# EAGLE design msp430g2330_dip (EAGLE 6.5.0)
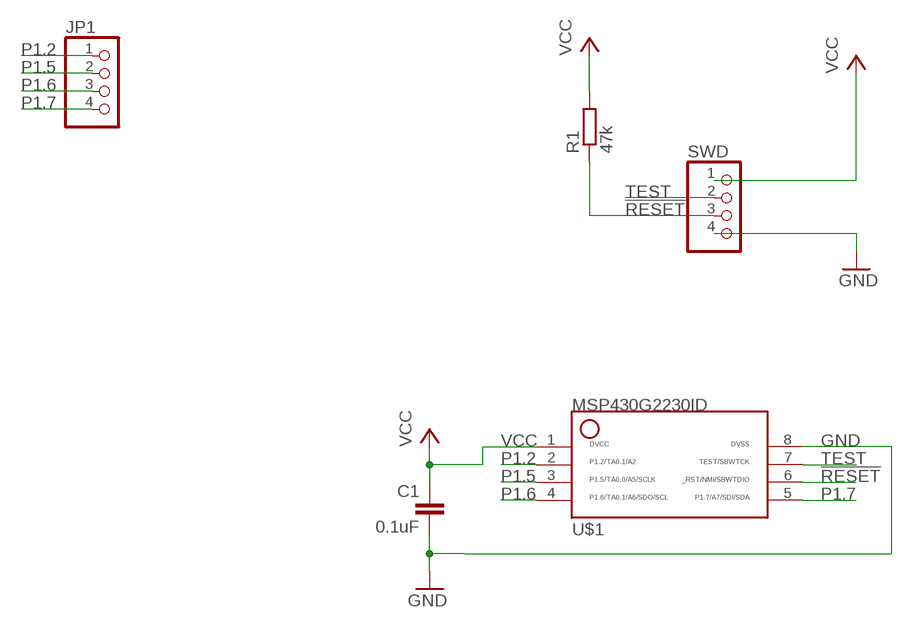
[diagram p0: schematic, sheet 1]

## Parts
C1  0.1uF  C-EUC0805  [C0805]
JP1  PINHD-1X4  [1X04]
R1  47k  R-EU_R0805  [R0805]
SWD  PINHD-1X4  [1X04]
U$1  MSP430G2230ID  [SO08]

## Nets
!RESET: R1.1 SWD.3 U$1.6
GND [GND]: C1.2 SWD.4 U$1.8
P1.2: JP1.1 U$1.2
P1.5: JP1.2 U$1.3
P1.6: JP1.3 U$1.4
P1.7: JP1.4 U$1.5
TEST: SWD.2 U$1.7
VCC [VCC]: C1.1 R1.2 SWD.1 U$1.1

## Library data of the parts
C1 = resistor:C-EU: CAPACITOR, European symbol
JP1 SWD = pinhead:PINHD-1X4: PIN HEADER
R1 = resistor:R-EU_: RESISTOR, European symbol
U$1 = thierry_eagle:MSP430G2230ID

## Net classes
0 default: width 0.305 mm, drill 0.508 mm
1 GND: width 0.813 mm, drill 0.508 mm
2 VCC: width 0.813 mm, drill 0.508 mm

## Board
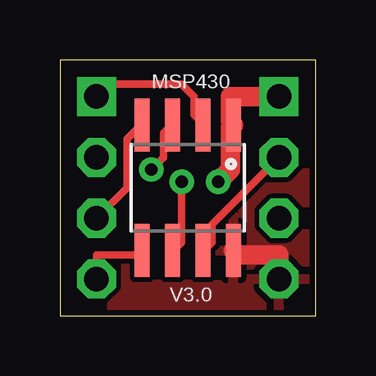
[diagram p1: board, top side]
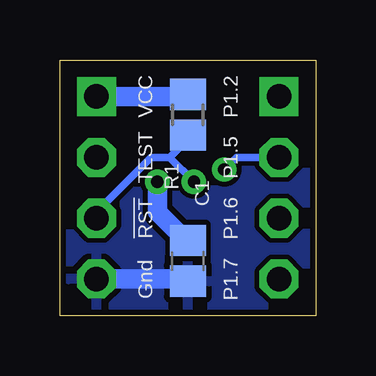
[diagram p2: board, bottom side, seen from below]

Size 10.67 x 10.67 mm. Coordinates in mm from the lower left corner, seen from the top.
Outline: 0,0 10.67,0 10.67,10.67 0,10.67 0,0
Copper layers (1*16): Top 0.035mm / dielectric 1.5mm / Bottom 0.035mm
Design rules "SparkFun *": minimum track width 12mil, minimum drill 20mil, track to track 8mil, track to pad 8mil, pad to pad 8mil, via to via 8mil, smd to smd 8mil, copper to edge 10mil, drill to drill 8mil, minimum pad ring 12mil, minimum via ring 10mil, stop-mask expansion 4mil, vias tented up to drill 25mil, thermal gap 10mil

### Footprints (pad centres in the part's own frame; a part is rotated, then mirrored left to right if it is on the bottom)
C0805 = smd 1.3 x 1.5: 1 -0.85,0; 2 0.85,0
1X04 = drill 1.016 square: 1 -3.81,0 | drill 1.016 octagon: 2 -1.27,0; 3 1.27,0; 4 3.81,0
R0805 = smd 1.3 x 1.5: 1 -0.85,0; 2 0.85,0
SO08 = smd 0.61 x 2.21: 1 -1.905,-2.616; 2 -0.635,-2.616; 3 0.635,-2.616; 4 1.905,-2.616; 5 1.905,2.616; 6 0.635,2.616; 7 -0.635,2.616; 8 -1.905,2.616

### Placement (x,y rotation side)
C1  5.33,2.29 270 bottom
JP1  1.52,5.33 270 top
R1  5.33,8.38 90 bottom
SWD  9.14,5.33 270 top
U$1  5.33,5.33 180 top

### Tracks (layer width: path | path; a pad name or v marks a point on that pad's centre or on a via)
!RESET  (via drill 0.51)
  Top 0.305: v5.08,5.59 5.08,3.05 4.83,2.79 U$1.6
  Bottom 0.305: 6.1,6.6 5.33,7.37 R1.1 | 6.1,6.6 6.86,6.6 9.14,4.32 SWD.3 | 6.1,6.6 v5.08,5.59
GND
  Top 0.813: SWD.4 9.14,2.54 7.37,2.54 U$1.8
  Bottom 0.813: SWD.4 5.59,1.52 5.33,1.27 C1.2
  pour Top: -1.02,11.68 11.68,11.68 11.68,-1.02 -1.02,-1.02
  pour Bottom: -1.02,11.68 11.68,11.68 11.68,-1.02 -1.02,-1.02
P1.2
  Top 0.305: JP1.1 1.52,9.65 5.08,9.65 5.59,9.14 5.59,8.38 5.84,8.13 U$1.2
P1.5  (via drill 0.51)
  Top 0.305: v3.81,6.1 4.32,6.6 4.32,7.62 4.57,7.87 U$1.3
  Bottom 0.305: v3.81,6.1 3.3,6.6 JP1.2
P1.6
  Top 0.305: JP1.3 2.79,5.33 2.79,7.37 3.3,7.87 U$1.4
P1.7
  Top 0.305: JP1.4 1.52,2.54 3.3,2.54 U$1.5
TEST
  Top 0.305: SWD.2 6.35,3.81 6.35,3.05 6.1,2.79 U$1.7
VCC  (via drill 0.51)
  Top 0.813: v6.6,5.59 7.11,6.1 7.11,7.87 U$1.1 7.11,8.13 7.11,9.14 SWD.1
  Bottom 0.813: SWD.1 5.33,9.14 R1.2 | v6.6,5.59 6.6,4.32 5.33,3.05 C1.1

### Text on the board
tNames: MSP430 | V3.0
bNames: P1.2 | VCC | P1.5 | TEST | P1.6 | !RST | P1.7 | Gnd